# EAGLE design AlexRJ12-14 (EAGLE 7.7.0)
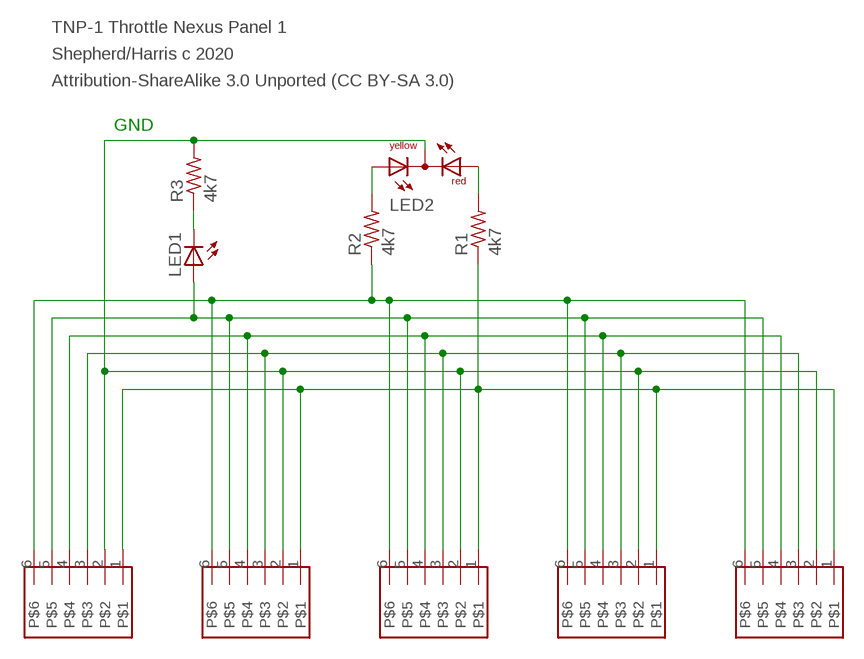
[diagram p0: schematic, sheet 1]

## Parts
LED1  LED5MM  [LED5MM]
LED2  DUOLED-RY-C  [DUOLED-C-5MM]
R1  4k7  R-US_0207/7  [0207/7]
R2  4k7  R-US_0207/7  [0207/7]
R3  4k7  R-US_0207/7  [0207/7]
U$1  RJ12-6  [RJ12-6]
U$2  RJ12-6  [RJ12-6]
U$3  RJ12-6  [RJ12-6]
U$4  RJ12-6  [RJ12-6]
U$5  RJ12-6  [RJ12-6]

## Nets
L1: R1.1 U$1.1 U$2.1 U$3.1 U$4.1 U$5.1
L2: LED2.C R3.2 U$1.2 U$2.2 U$3.2 U$4.2 U$5.2
L3: U$1.3 U$2.3 U$3.3 U$4.3 U$5.3
L4: U$1.4 U$2.4 U$3.4 U$4.4 U$5.4
L5: LED1.A U$1.5 U$2.5 U$3.5 U$4.5 U$5.5
L6: R2.1 U$1.6 U$2.6 U$3.6 U$4.6 U$5.6
N$1: LED2.AR R1.2
N$2: LED2.AX(AY) R2.2
N$3: LED1.K(C) R3.1

## Notes on the sheet
- TNP-1 Throttle Nexus Panel 1
- Shepherd/Harris c 2020
- Attribution-ShareAlike 3.0 Unported (CC BY-SA 3.0)
- GND

## Library data of the parts
LED1 = led:LED: LED OSRAM: - CHIPLED LG R971, LG N971, LY N971, LG Q971, LY Q971, LO R971, LY R971 LH N974, LH R974 LS Q976, LO Q976, LY Q976 LO Q996 - Hyper CHIPLED LW Q18S LB Q993, LB Q99A, LB R99A - SideLED LS A670, LO A670, LY A670, LG A670, LP A670 LB A673, LV A673, LT A673, LW A673 LH A674 LY A675 LS A676, LA A676, LO A676, LY A676, LW A676 LS A679, LY A679, LG A679 - Hyper Micro SIDELED® LS Y876, LA Y876, LO Y876, LY Y876 LT Y87S - SmartLED LW L88C, LW L88S LB L89C, LB L89S, LG L890 LS L89K, LO L89K, LY L89K LS L896, LA L896, LO L896, LY L896 - TOPLED LS T670, LO T670, LY T670, LG T670, LP T670 LSG T670, LSP T670, LSY T670, LOP T670, LYG T670 LG T671, LOG T671, LSG T671 LB T673, LV T673, LT T673, LW T673 LH T674 LS T676, LA T676, LO T676, LY T676, LB T676, LH T676, LSB T676, LW T676 LB T67C, LV T67C, LT T67C, LS T67K, LO T67K, LY T67K, LW E67C LS E67B, LA E67B, LO E67B, LY E67B, LB E67C, LV E67C, LT E67C LW T67C LS T679, LY T679, LG T679 LS T770, LO T770, LY T770, LG T770, LP T770 LB T773, LV T773, LT T773, LW T773 LH T774 LS E675, LA E675, LY E675, LS T675 LS T776, LA T776, LO T776, LY T776, LB T776 LHGB T686 LT T68C, LB T68C - Hyper Mini TOPLED® LB M676 - Mini TOPLED Santana® LG M470 LS M47K, LO M47K, LY M47K Source: http://www.osram.convergy.de LUXEON: - LUMILED® LXK2-PW12-R00, LXK2-PW12-S00, LXK2-PW14-U00, LXK2-PW14-V00 LXK2-PM12-R00, LXK2-PM12-S00, LXK2-PM14-U00 LXK2-PE12-Q00, LXK2-PE12-R00, LXK2-PE12-S00, LXK2-PE14-T00, LXK2-PE14-U00 LXK2-PB12-K00, LXK2-PB12-L00, LXK2-PB12-M00, LXK2-PB14-N00, LXK2-PB14-P00, LXK2-PB14-Q00 LXK2-PR12-L00, LXK2-PR12-M00, LXK2-PR14-Q00, LXK2-PR14-R00 LXK2-PD12-Q00, LXK2-PD12-R00, LXK2-PD12-S00 LXK2-PH12-R00, LXK2-PH12-S00 LXK2-PL12-P00, LXK2-PL12-Q00, LXK2-PL12-R00 Source: www.luxeon.com KINGBRIGHT: KA-3528ASYC Source: www.kingbright.com
LED2 = led:DUOLED-RY-C: DUO LED 2 colors (red/yellow), 5 mm, round, common Cathode www.ligitek.com or other producers.
R1-R3 = rcl:R-US_: RESISTOR, American symbol
U$1-U$5 = RJ12-6 dph:RJ12-6

## Board
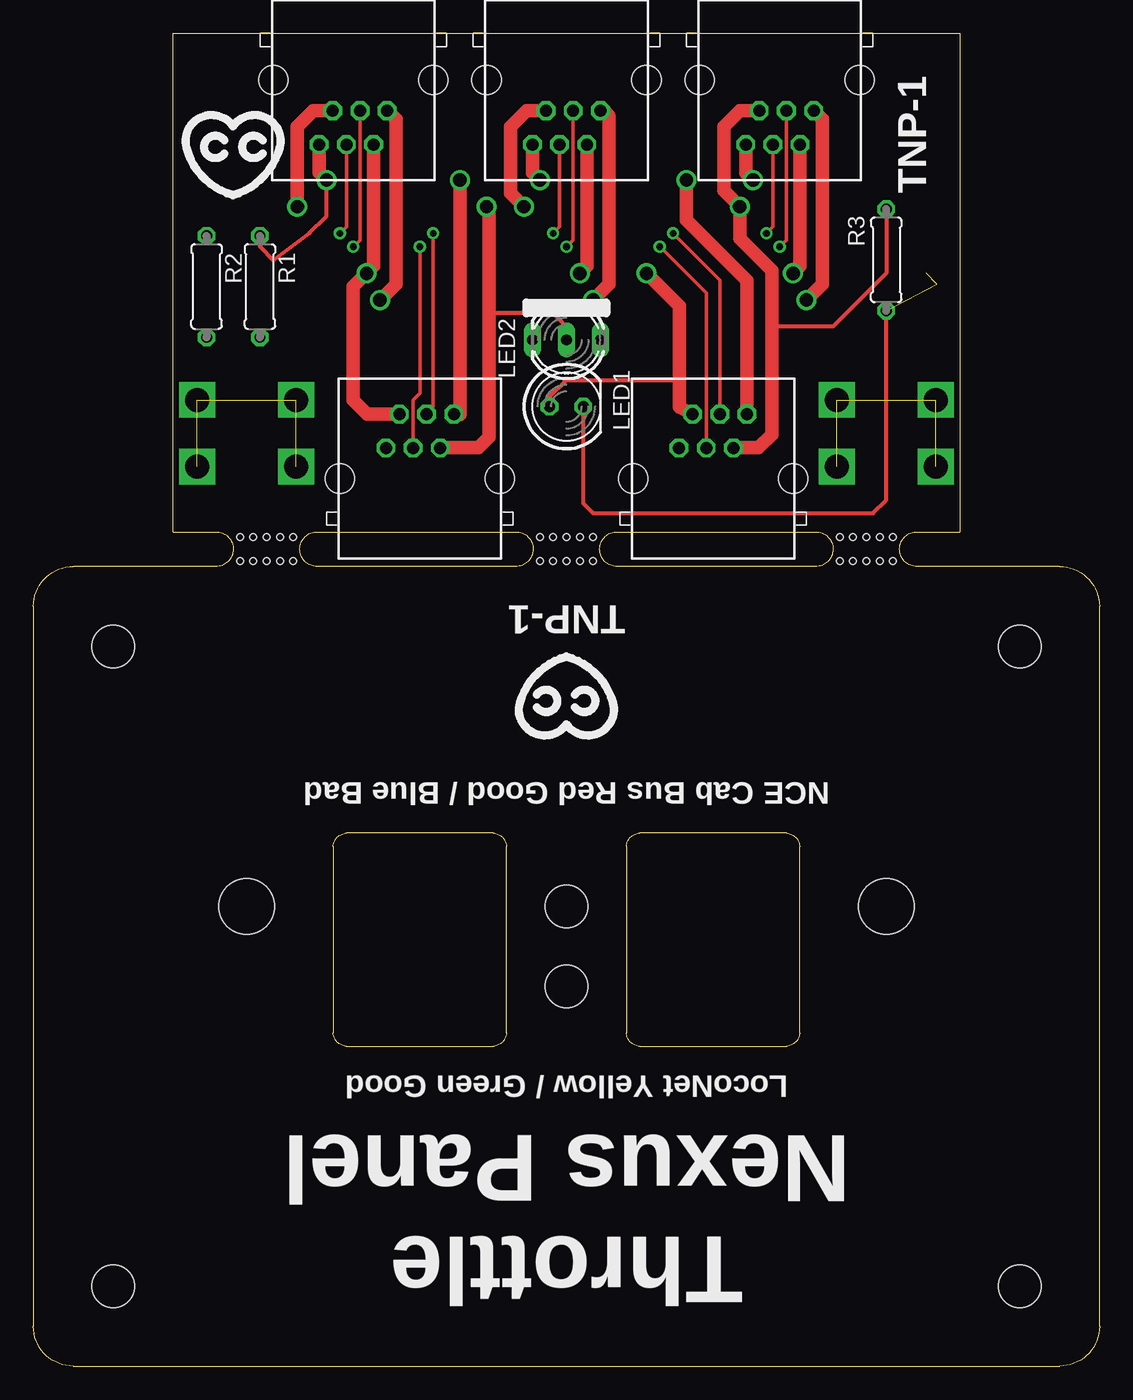
[diagram p1: board, top side]
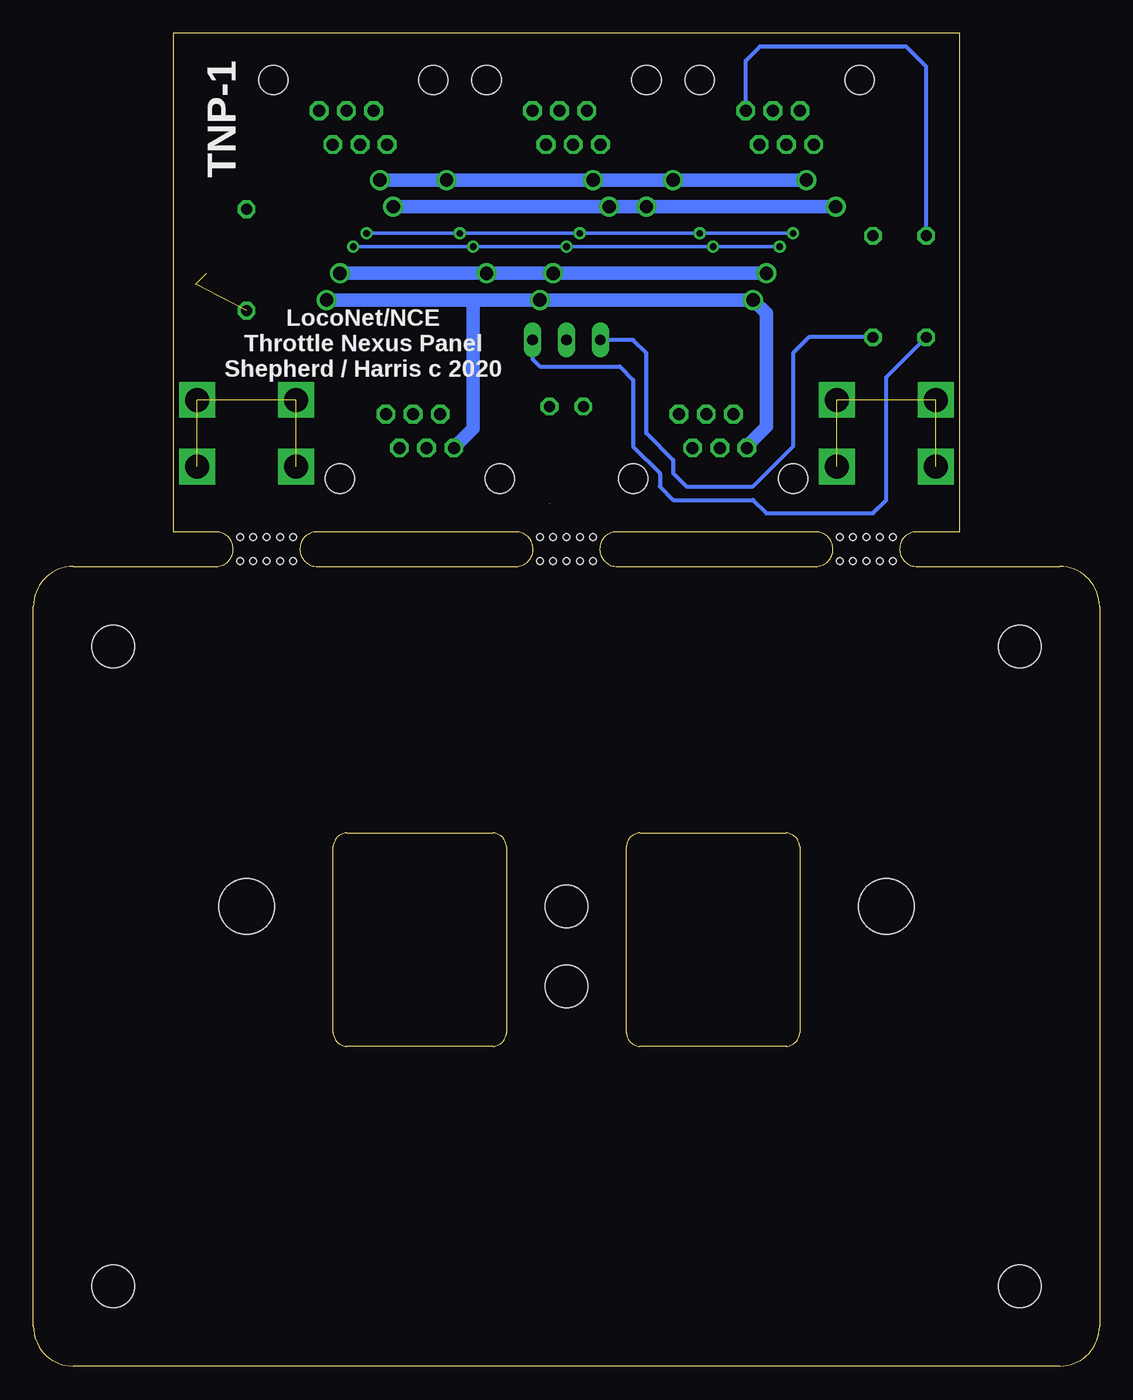
[diagram p2: board, bottom side, seen from below]

Size 80 x 100 mm. Coordinates in mm from the lower left corner, seen from the top.
Outline: 3,0 77,0 arc90 80,3 80,57 arc90 77,60 66.3,60 arc-176 66.2,62.6 69.5,62.6 69.5,100 10.5,100 10.5,62.6 13.7,62.6 arc-176 13.8,60 3,60 arc90 0,57 0,3 arc90 3,0
Outline: 58.8,60 43.8,60 arc-176 43.7,62.6 58.7,62.6 arc-176 58.8,60
Outline: 36.3,60 21.3,60 arc-176 21.2,62.6 36.2,62.6 arc-176 36.3,60
Outline: 57.5,25 57.5,39 arc85 56.5,40 45.5,40 arc85 44.5,39 44.5,25 arc85 45.5,24 56.5,24 arc85 57.5,25
Outline: 35.5,25 35.5,39 arc85 34.5,40 23.5,40 arc85 22.5,39 22.5,25 arc85 23.5,24 34.5,24 arc85 35.5,25
Copper layers (1*16): Top 0.035mm / dielectric 1.5mm / Bottom 0.035mm
Design rules "default *": minimum track width 10mil, minimum drill 24mil, track to track 6mil, track to pad 6mil, pad to pad 8mil, via to via 8mil, smd to smd 8mil, copper to edge 10mil, drill to drill 8mil, minimum pad ring 10mil, minimum via ring 8mil, stop-mask expansion 4mil, vias tented up to drill 0mil, thermal gap 10mil
Holes 3.2 mm at 6,6 74,54 6,54 74,6 40,28.5 40,34.5
Holes 4.2 mm at 64,34.5 16,34.5
Holes 0.5 mm at 15.5,62.2 16.5,62.2 17.5,62.2 18.5,62.2 19.5,62.2 15.5,60.4 16.5,60.4 17.5,60.4 18.5,60.4 19.5,60.4 38,62.2 39,62.2 40,62.2 41,62.2 42,62.2 38,60.4 39,60.4 40,60.4 41,60.4 42,60.4 60.5,62.2 61.5,62.2 62.5,62.2 63.5,62.2 64.5,62.2 60.5,60.4 61.5,60.4 62.5,60.4 63.5,60.4 64.5,60.4

### Footprints (pad centres in the part's own frame; a part is rotated, then mirrored left to right if it is on the bottom)
LED5MM = drill 0.813 octagon: A -1.27,0; K 1.27,0
DUOLED-C-5MM = drill 0.813 long: AR 2.54,0; AX -2.54,0; C 0,0
0207/7 = drill 0.813 octagon: 1 -3.81,0; 2 3.81,0
RJ12-6 = drill 0.9 pad 1.27 octagon: 1 -2.55,-4.84; 2 -1.53,-2.3; 3 -0.51,-4.84; 4 0.51,-2.3; 5 1.53,-4.84; 6 2.55,-2.3 | hole 2.2: -6,0; 6,0

### Placement (x,y rotation side)
LED1  40,72 0 top
LED2  40,77 180 top
R1  17,81 270 top
R2  13,81 270 top
R3  64,83 90 top
U$1  29,66.6 180 top
U$2  51,66.6 180 top
U$3  24,96.5 0 top
U$4  40,96.5 0 top
U$5  56,96.5 0 top

### Tracks (layer width: path | path; a pad name or v marks a point on that pad's centre or on a via)
L1  (via drill 1)
  Top 0.305: v22,89 22,86.3 20.7,85 18,83 17,84 R1.1
  Top 1.016: U$3.1 21.45,89.55 v22,89 | U$5.1 53.45,89.55 v54,89 | U$4.1 37.45,89.55 v38,89 | v32,89 32,71.39 U$1.1 | v49,89 49,86 53.55,81.45 U$2.1
  Bottom 1.016: v22,89 v32,89 v38,89 v49,89 v54,89
L2  (via drill 1)
  Top 0.305: 34.2,79 39,79 40,78 LED2.C | R3.2 64,82 60,78 55.4,78
  Top 1.016: U$3.2 21,94.2 19.8,93 v19.8,87 | U$5.2 53,94.2 51.8,93 51.8,88.2 v53,87 53,84.6 55.4,82.2 55.4,78 55.4,69.9 54.4,68.9 U$2.2 | U$4.2 37,94.2 35.8,93 35.8,88 v36.8,87 | U$1.2 33.4,68.9 34.2,69.7 34.2,79 34.2,86.8 v34,87
  Bottom 1.016: v19.8,87 v34,87 v36.8,87 v53,87
L3  (via drill 0.5)
  Top 0.254: U$3.3 23.49,85.51 v23,85 | U$5.3 55.49,85.49 v55,85 | U$4.3 39.49,85.49 v39,85 | v48,85 51.51,81.49 U$2.3 | U$1.3 29.51,71.51 30,72 v30,85
  Bottom 0.254: v23,85 v30,85 v39,85 v48,85 v55,85
L4  (via drill 0.5)
  Top 0.254: U$3.4 24.5,84.5 v24,84 | U$4.4 40.5,84.5 v40,84 | U$5.4 56.5,84.5 v56,84 | v47,84 50.49,80.51 U$2.4 | U$1.4 28.49,72.49 29,73 v29,84
  Bottom 0.254: v24,84 v29,84 v40,84 v47,84 v56,84
L5  (via drill 1)
  Top 0.305: 48.47,74 40,74 38.73,72.73 LED1.A
  Top 1.016: U$3.5 25.53,82.53 v25,82 24,81 24,72.5 25.06,71.44 U$1.5 | U$5.5 57.53,82.53 v57,82 | U$4.5 41.53,82.53 v41,82 | v46,82 48.47,79.53 48.47,74 48.47,71.94 U$2.5
  Bottom 1.016: v25,82 v41,82 v46,82 v57,82
L6  (via drill 1)
  Top 1.016: v26,80 27.2,81.2 27.2,93.55 U$3.6 | v58,80 59.2,81.2 59.2,93.55 U$5.6 | U$4.6 42.8,94.2 43.2,93.8 43.2,81.2 v42,80
  Bottom 0.305: R2.1 13,97.5 14.5,99 25.5,99 26.55,97.95 U$3.6
  Bottom 1.016: 47,80 v42,80 v26,80 25,79 25,70.5 26.45,69.05 U$1.6 | 47,80 v58,80 | 47,80 47,70.35 U$2.6
N$1
  Bottom 0.305: R1.2 21.81,77.19 23,76 23,69 26,66 31,66 32,67 32,68 34,70 34,76 35,77 LED2.AR
N$2
  Bottom 0.305: R2.2 16,74.19 16,65 17,64 25,64 26,65 32,65 33,66 33,67 35,69 35,74 36,75 42,75 42.54,75.54 LED2.AX
N$3  (3 unrouted)
  Top 0.305: R3.1 64,65 63,64 42,64 41.27,64.73 LED1.K
N$5  (via drill 1.8)  (3 unrouted)
  other vias: 12.3,72.5 12.3,67.5 19.7,67.5 19.7,72.5
N$7  (via drill 1.8)  (3 unrouted)
  other vias: 60.3,72.5 60.3,67.5 67.7,67.5 67.7,72.5

### Text on the board
tPlace: TNP-1 | TNP-1 | NCE Cab Bus Red Good / Blue Bad | LocoNet Yellow / Green Good | Throttle / Nexus Panel
bPlace: TNP-1 | LocoNet/NCE / Throttle Nexus Panel / Shepherd / Harris c 2020